# Altium schematic sheet SY_HR08_MCU_USB_V1.1.SchDoc
size A3; PageSetup: Record=PageOptions|CenterHorizontal=True|CenterVertical=True|PrintScale=0.71|XCorrection=1.00|YCorrection=1.00|PrintKind=2|BorderSize=5000000|LeftOffset=0|BottomOffset=0|Orientation=2|PaperLength=1000|PaperWidth=1000|Scale=100|PaperSource=7|PrintQuality=-3|MediaType=1|DitherType=10|PrintScaleMode=1|PaperKind=A4|PaperIndex=9
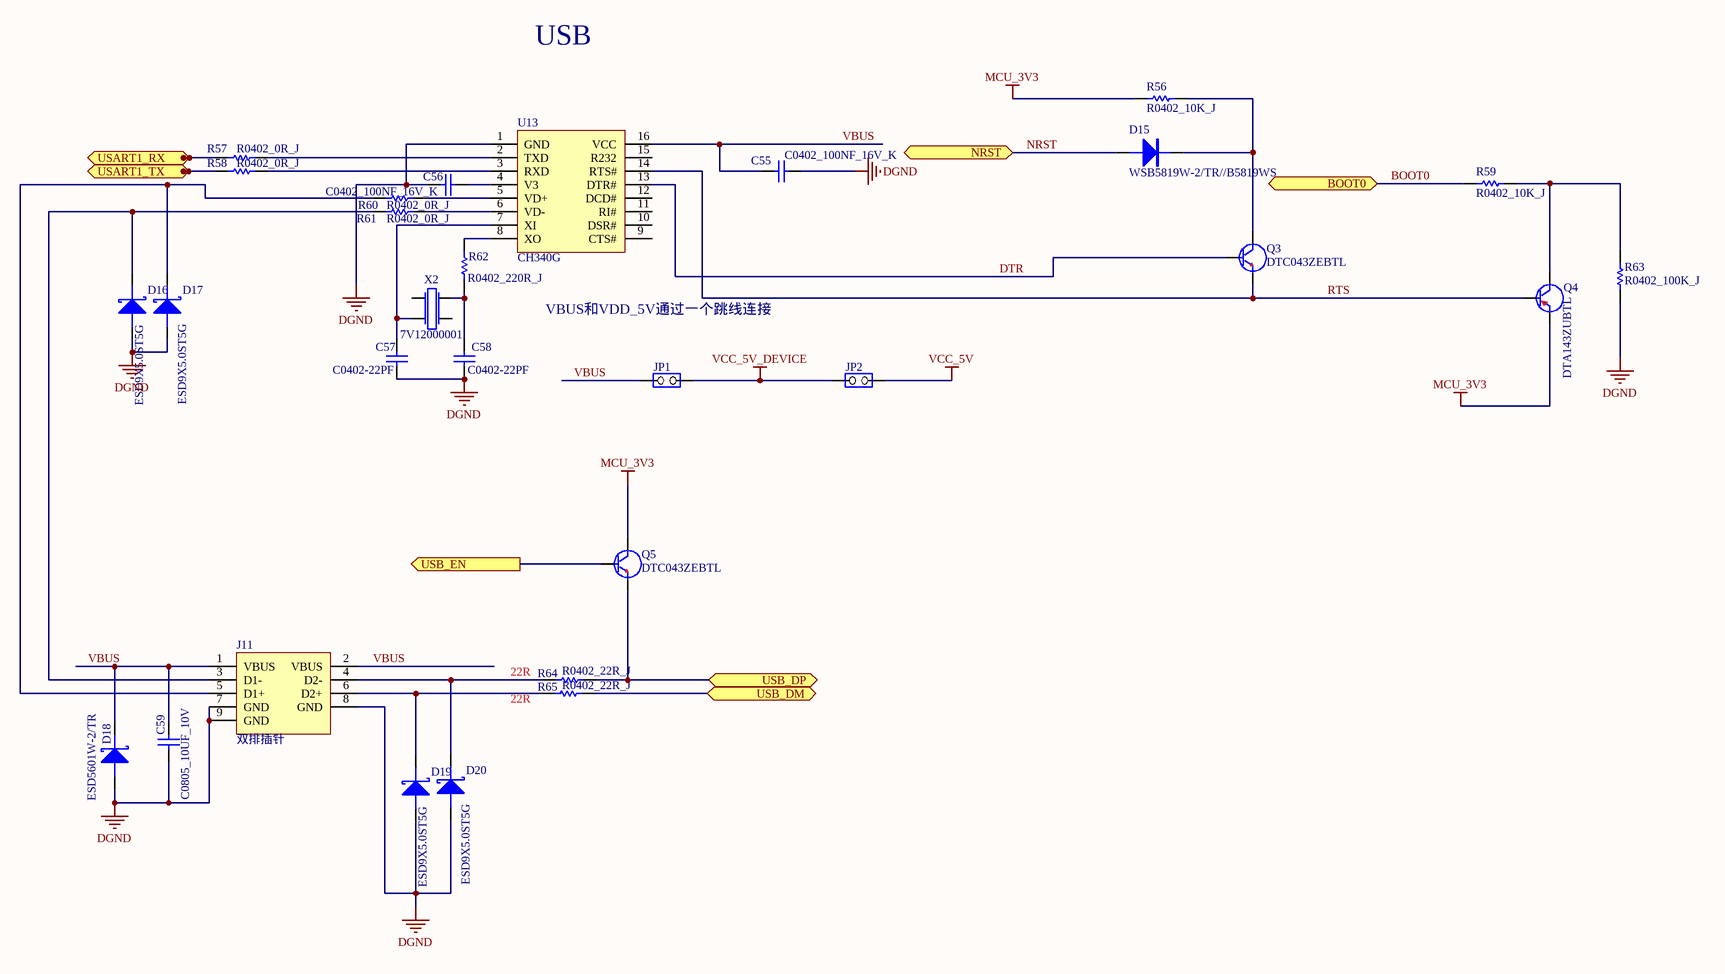
[diagram p0: SY_HR08_MCU_USB_V1.1.SchDoc]

## Parts
C55  C0402_100NF_16V_K  [CAP0402_HQ]
C56  C0402_100NF_16V_K  [CAP0402_HQ]
C57  C0402-22PF  [CAP0402_HQ]
C58  C0402-22PF  [CAP0402_HQ]
C59  C0805_10UF_10V  [CAP0805-B]
D15  WSB5819W-2/TR//B5819WS  [WSB5819W-2$2F$TR]
D16  ESD9X5.0ST5G  [ESD9X5.0ST5G]
D17  ESD9X5.0ST5G  [ESD9X5.0ST5G]
D18  ESD5601W-2/TR  [ESD5601W-2$2F$TR]
D19  ESD9X5.0ST5G  [ESD9X5.0ST5G]
D20  ESD9X5.0ST5G  [ESD9X5.0ST5G]
J11  双排插针  [USB-9PIN]
JP1  单排插针  [CON1X2(2.54mm)]  (value not drawn)
JP2  单排插针  [CON1X2(2.54mm)]  (value not drawn)
Q3  DTC043ZEBTL  [DTC043ZEBTL$2F$$2F$DTC143ZE$2F$$2F$LDTC143ZET1G]
Q4  DTA143ZUBTL  [UMT3F]
Q5  DTC043ZEBTL  [DTC043ZEBTL$2F$$2F$DTC143ZE$2F$$2F$LDTC143ZET1G]
R56  R0402_10K_J  [RES0402_HQ]
R57  R0402_0R_J  [RES0402_HQ]
R58  R0402_0R_J  [RES0402_HQ]
R59  R0402_10K_J  [RES0402_HQ]
R60  R0402_0R_J  [RES0402_HQ]
R61  R0402_0R_J  [RES0402_HQ]
R62  R0402_220R_J  [RES0402_HQ]
R63  R0402_100K_J  [RES0402_HQ]
R64  R0402_22R_J  [RES0402_HQ]
R65  R0402_22R_J  [RES0402_HQ]
U13  CH340G  [CH340G]
X2  7V12000001  [7V12000001]

## Ports
BOOT0 (bidir), NRST (bidir), USART1_RX (out), USART1_TX (in), USB_DM (bidir), USB_DP (bidir), USB_EN (out)

## Nets
DGND: C55.2 C56.1 C57.1 C58.1 C59.1 D16.2 D17.2 D18.2 D19.2 D20.2 J11.7(GND) J11.8(GND) J11.9(GND) R63.1 U13.1(GND)
MCU_3V3: Q4.2(E) Q5.3(C) R56.1
VCC_5V: JP2.2(NO)
VCC_5V_DEVICE: JP1.2(NO) JP2.1(COMMON)
BOOT0: R59.1 ; port BOOT0
DTR: Q3.1(B) U13.13(DTR#)
NRST: D15.2 ; port NRST
RTS: Q3.2(E) Q4.1(B) U13.14(RTS#)
USART1_RX: R57.1 ; port USART1_RX
USART1_TX: R58.1 ; port USART1_TX
USB_DM: R65.2 ; port USB_DM
USB_DP: Q5.2(E) R64.2 ; port USB_DP
USB_EN: Q5.1(B) ; port USB_EN
VBUS: C55.1 C59.2 D18.1 J11.1(VBUS) J11.2(VBUS) JP1.1(COMMON) U13.16(VCC)
NetC56_2: C56.2 U13.4(V3)
NetC57_2: C57.2 U13.7(XI) X2.1
NetC58_2: C58.2 R62.1 X2.3
NetD15_1: D15.1 Q3.3(C) R56.2
NetD16_1: D16.1 J11.3(D1-) R61.1
NetD17_1: D17.1 J11.5(D1+) R60.1
NetD19_1: D19.1 J11.6(D2+) R65.1
NetD20_1: D20.1 J11.4(D2-) R64.1
NetQ4_3: Q4.3(C) R59.2 R63.2
NetR57_2: R57.2 U13.2(TXD)
NetR58_2: R58.2 U13.3(RXD)
NetR60_2: R60.2 U13.5(VD+)
NetR61_2: R61.2 U13.6(VD-)
NetR62_2: R62.2 U13.8(XO)

Not connected (* = marked no-connect by the designer): U13 9(CTS#) 10(DSR#) 11(RI#) 12(DCD#) 15(R232); X2 2 4

## Notes on the sheet
- USB
- VBUS和VDD_5V通过一个跳线连接
- 22R

## Library data of the parts
C55 C56 = C0402_100NF_16V_K: 电容_100nF_0402_X7R_16V_K; Geometry.Height: 0.55mm; Value: 100NF
C57 C58 = C0402-22PF: 电容_22pF_0402_C0G_50V_J; Geometry.Height: 0.55mm; Value: 22pf
C59 = C0805_10UF_10V: 电容_10uF_0805_X5R_10V_K
D15 = WSB5819W-2/TR//B5819WS: 肖特基二极管_1A_SOD323; Manufacturer: Will(韦尔)//ChangJiang Elec Tech(长电科技); Part Number: HQ11200391298; Geometry.Height: 1.0mm; Value: WSB5819W-2/TR//B5819WS
D16 D17 D19 D20 = ESD9X5.0ST5G: TVS_单路_单向_5.0V_65pF; Manufacturer: ONSEMI(安森美); Part Number: HQ11510010010; Geometry.Height: 0.43mm
D18 = ESD5601W-2/TR: TVS_浪涌+静电二合一管_单向_7V_170pf; Manufacturer: Will(韦尔); Part Number: HQ11510029000; Geometry.Height: 1mm; Value: ESD5601W-2/TR
J11 = USB-9pin: 主板9pin 双USB接口  2.54mm
JP1 JP2 = JP2
Q3 Q5 = DTC043ZEBTL: NPN三极管_100mA_EMT3F
Q4 = DTA143ZUBTL: PNP三极管_100mA_UMT3F
R56 R59 = R0402_10K_J: 电阻10K(0402-0.0625W-J)
R57 R58 R60 R61 R64 R65 = R0402_0R_J: 电阻0R(0402-0.0625W-J)
R62 = R0402_220R_J: 电阻220R(0402-0.0625W-J)
R63 = R0402_100K_J: 电阻100K(0402-0.0625W-J)
U13 = CH340G: 接口芯片_USB转UART
X2 = 7V12000001: TXC 3225 7V系列晶体; Geometry.Height: 0.9mm; Value: 12M; Manufacturer: TXC